# Altium schematic sheet low voltage output controller.SchDoc
size A4
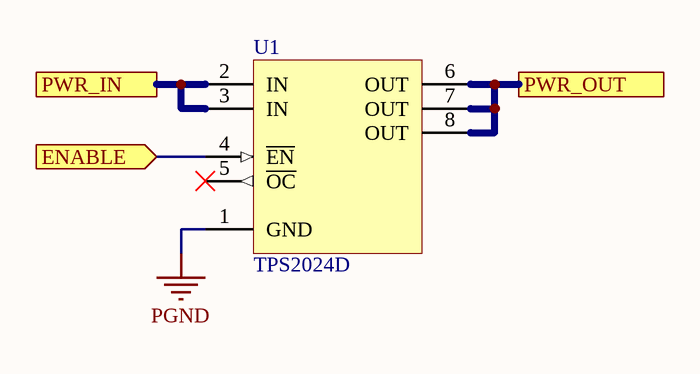
[diagram p0: low voltage output controller.SchDoc]

## Parts
U1  TPS2024D  [TPS2024D]

## Ports
ENABLE (in), PWR_IN, PWR_OUT

## Nets
PGND: U1.1(GND)
ENABLE: U1.4(~{EN}) ; port ENABLE
PWR_IN: U1.2(IN) U1.3(IN) ; port PWR_IN
PWR_OUT: U1.6(OUT) U1.7(OUT) U1.8(OUT) ; port PWR_OUT

Not connected (* = marked no-connect by the designer): U1 5(~{OC})*

## Library data of the parts
U1 = TPS2024D: TEXAS INSTRUMENTS - TPS2024D - IC, 3A PWR DIST SWITCH 8-SOIC; farnell: 1755295